# EAGLE board protol (EAGLE 6.6.0)
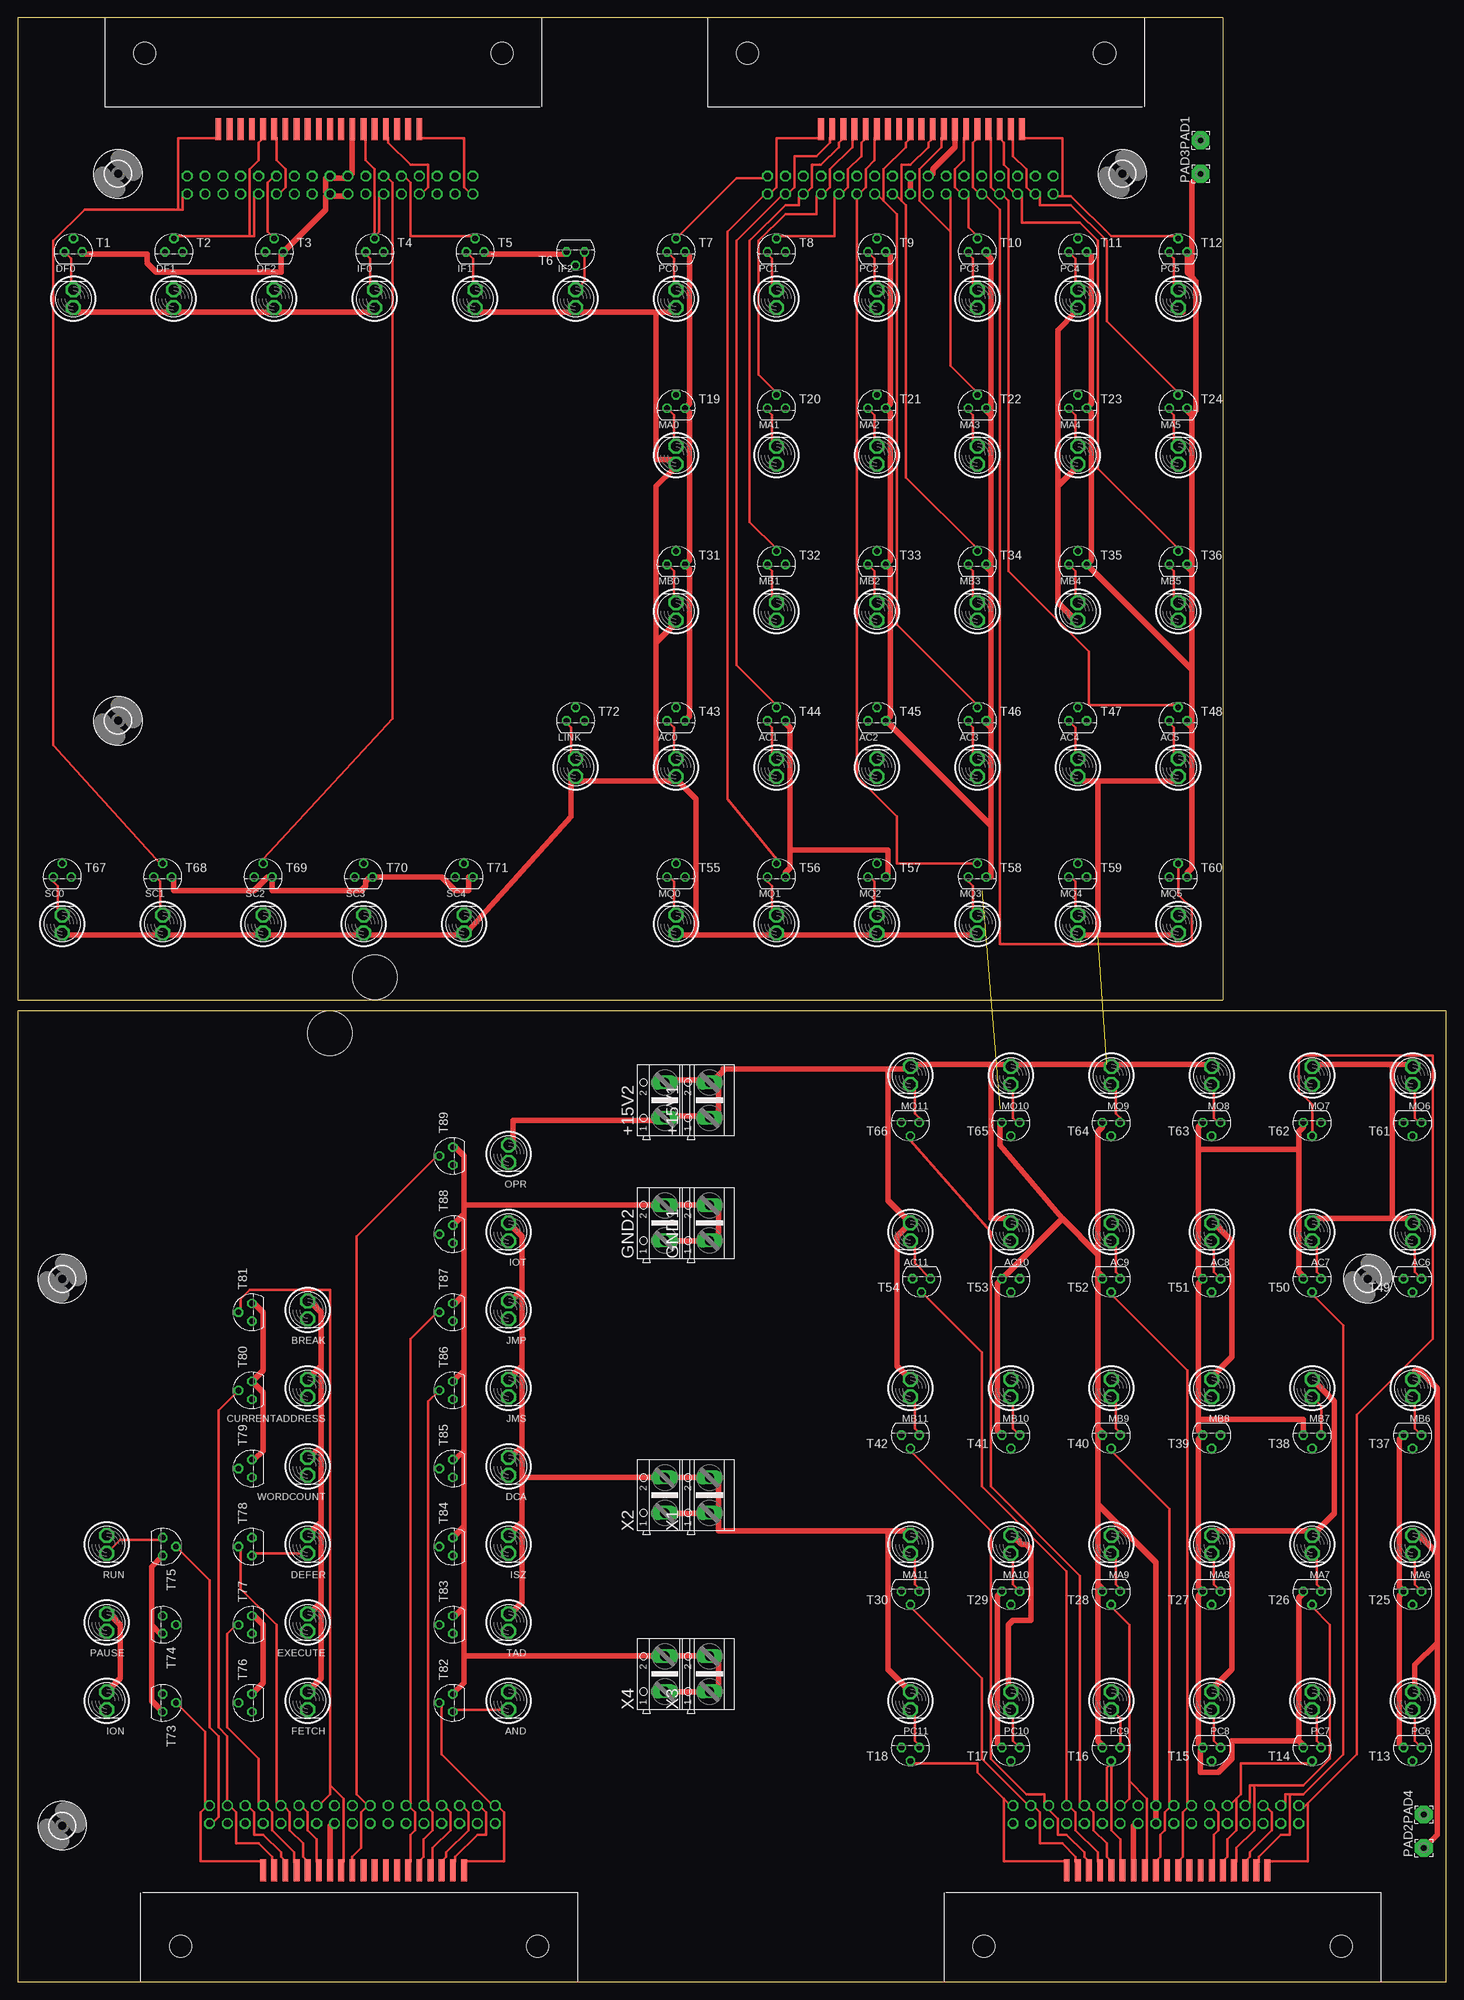
[diagram p2: board, top side]
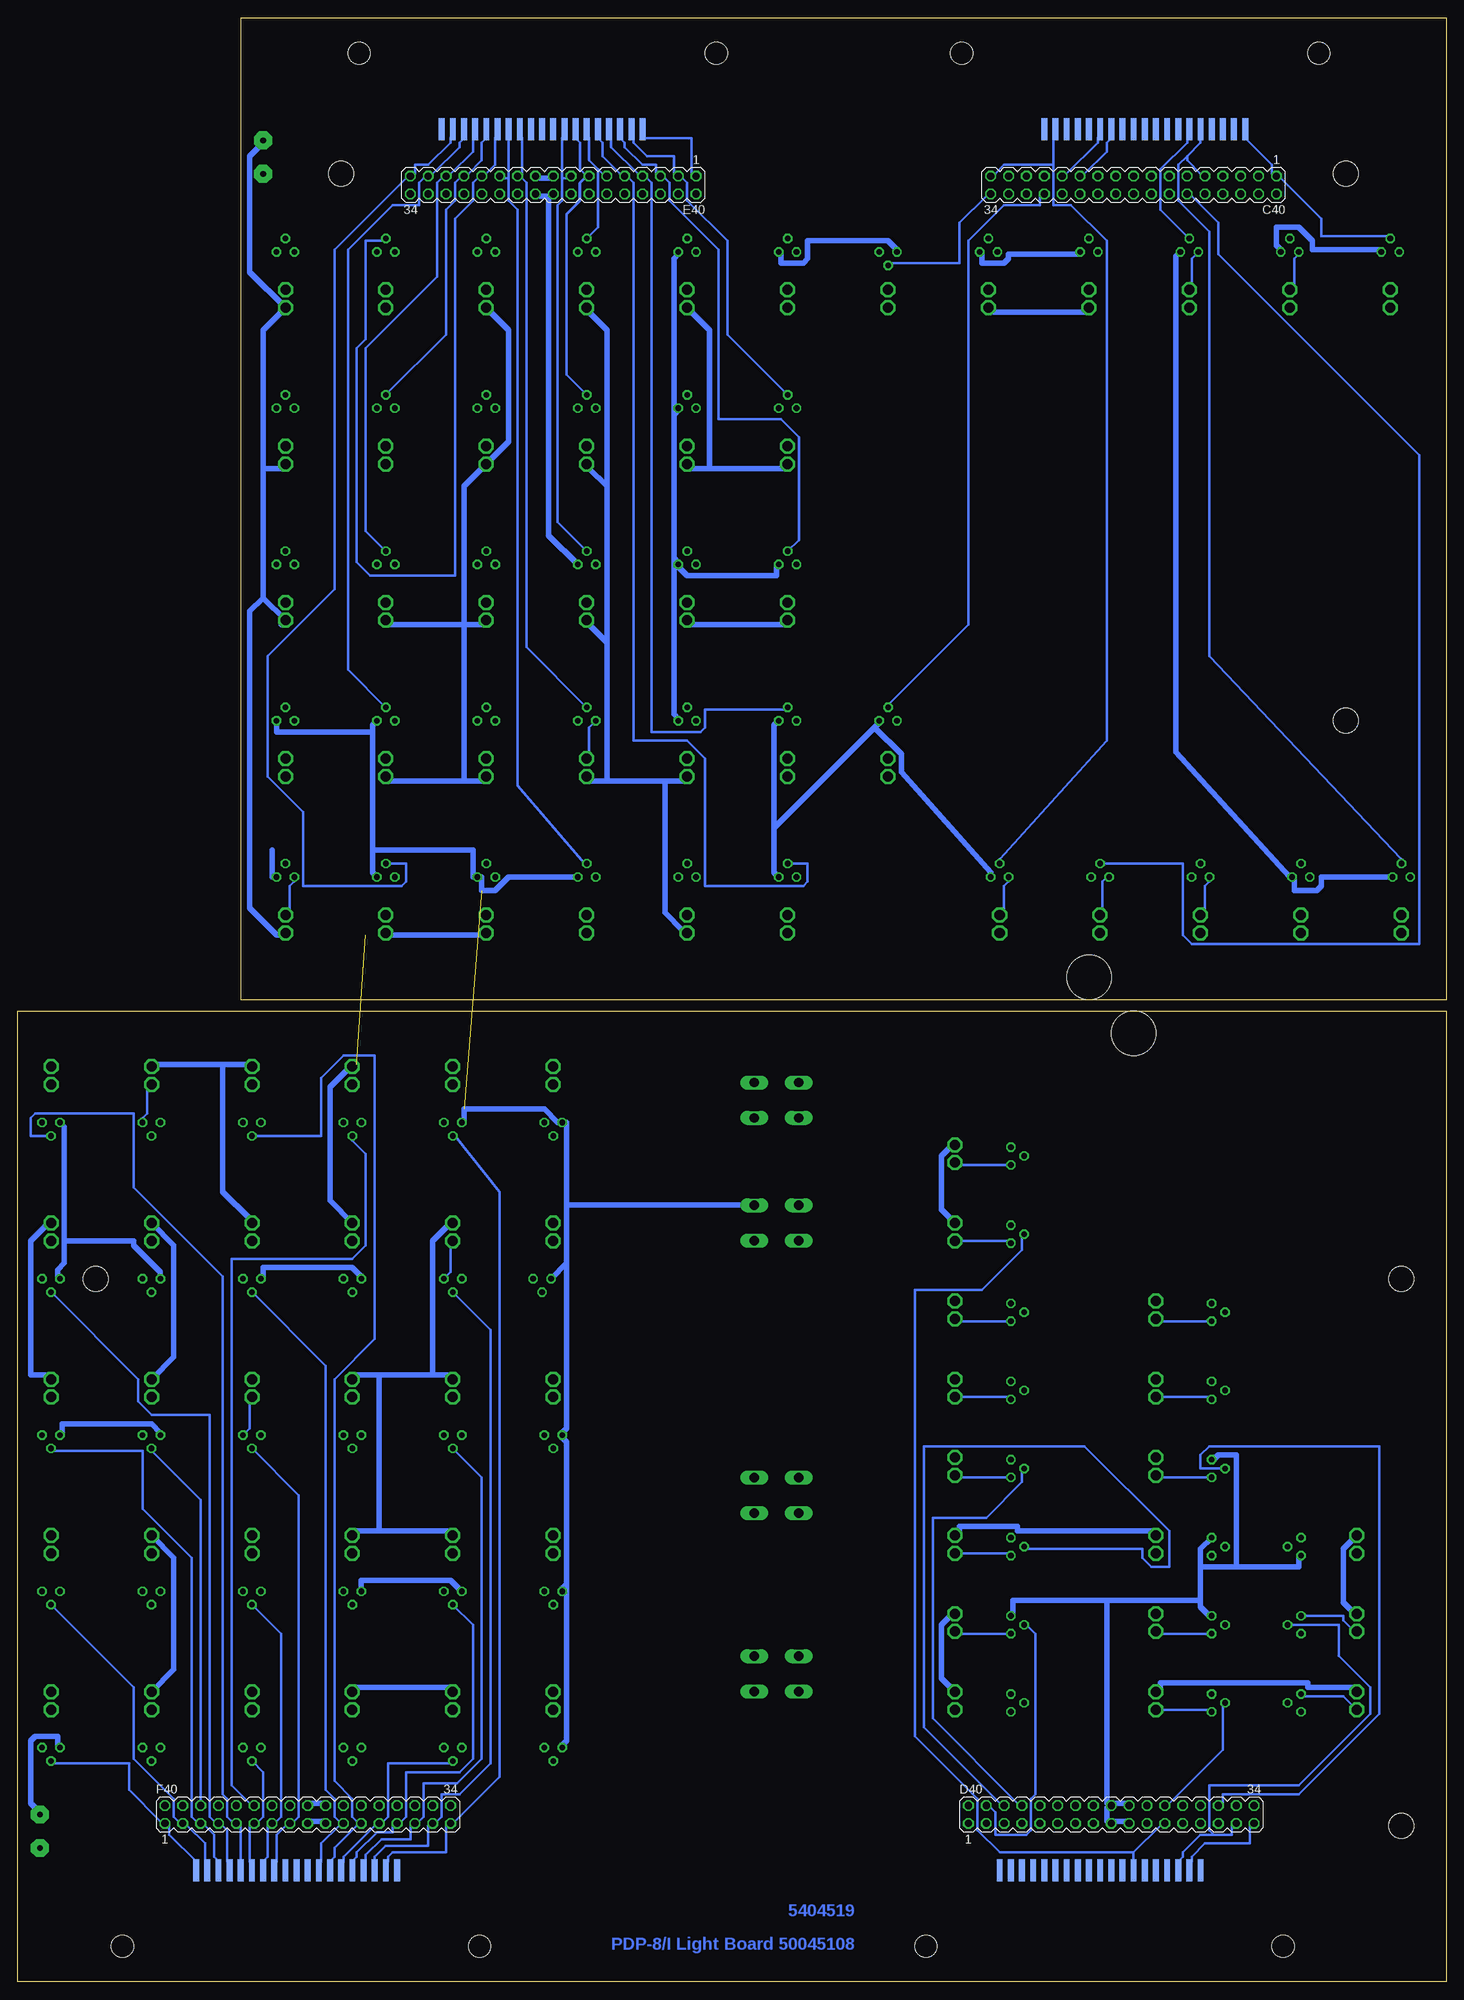
[diagram p3: board, bottom side, seen from below]

Size 203.2 x 279.4 mm. Coordinates in mm from the lower left corner, seen from the top.
Outline: 0,139.7 171.45,139.7 171.45,279.4 0,279.4 0,139.7
Outline: 203.2,138.11 0,138.11 0,0 203.2,0 203.2,138.11
Copper layers (1*16): Top 0.035mm / dielectric 1.5mm / Bottom 0.035mm
Design rules "15mils": minimum track width 15mil, minimum drill 24mil, track to track 15mil, track to pad 10mil, pad to pad 10mil, via to via 10mil, smd to smd 10mil, copper to edge 25mil, drill to drill 10mil, minimum pad ring 10mil, minimum via ring 8mil, stop-mask expansion 0mil, vias tented up to drill 0mil, thermal gap 10mil
Net classes: 1 supply: width 0.762 mm
Holes 6.35 mm at 50.8,142.88 44.45,134.94

## Footprints (pad centres in the part's own frame; a part is rotated, then mirrored left to right if it is on the bottom)
AK500/2 = drill 1.321 long: 1 -2.515,0; 2 2.515,0
BULB = drill 1.422 octagon: A 0,0; B 0,2.54
MA17-2 = drill 1.016 octagon: 1 -20.32,-1.27; 2 -20.32,1.27; 3 -17.78,-1.27; 4 -17.78,1.27; 5 -15.24,-1.27; 6 -15.24,1.27; 7 -12.7,-1.27; 8 -12.7,1.27; 9 -10.16,-1.27; 10 -10.16,1.27; 11 -7.62,-1.27; 12 -7.62,1.27; 13 -5.08,-1.27; 14 -5.08,1.27; 15 -2.54,-1.27; 16 -2.54,1.27; 17 0,-1.27; 18 0,1.27; 19 2.54,-1.27; 20 2.54,1.27; 21 5.08,-1.27; 22 5.08,1.27; 23 7.62,-1.27; 24 7.62,1.27; 25 10.16,-1.27; 26 10.16,1.27; 27 12.7,-1.27; 28 12.7,1.27; 29 15.24,-1.27; 30 15.24,1.27; 31 17.78,-1.27; 32 17.78,1.27; 33 20.32,-1.27; 34 20.32,1.27
FLEX19 = smd 3.175 x 0.838: 1 0,14.287; 2 0,12.7; 3 0,11.113; 4 0,9.525; 5 0,7.938; 6 0,6.35; 7 0,4.763; 8 0,3.175; 9 0,1.587; 10 0,0; 11 0,-1.587; 12 0,-3.175; 13 0,-4.763; 14 0,-6.35; 15 0,-7.938; 16 0,-9.525; 17 0,-11.113; 18 0,-12.7; 19 0,-14.287
2,54/0,8 = drill 0.813 pad 2.54 octagon: 1 0,0
TO92 = drill 0.813 octagon: 1 1.27,0; 2 0,1.905; 3 -1.27,0
STRAIN-RELIEF = hole 3.175: 7.62,56.515; 7.62,5.715
3,6 = hole 3.6: 0,0

## Placement (x,y rotation side)
+15V1  494864  [AK500/2]  98.42,125.41 90 top
+15V2  494864  [AK500/2]  92.08,125.41 90 top
AC0  [BULB]  93.66,171.45 0 top
AC1  [BULB]  107.95,171.45 0 top
AC2  [BULB]  122.24,171.45 0 top
AC3  [BULB]  136.53,171.45 0 top
AC4  [BULB]  150.81,171.45 0 top
AC5  [BULB]  165.1,171.45 0 top
AC6  [BULB]  198.44,107.95 180 top
AC7  [BULB]  184.15,107.95 180 top
AC8  [BULB]  169.86,107.95 180 top
AC9  [BULB]  155.57,107.95 180 top
AC10  [BULB]  141.29,107.95 180 top
AC11  [BULB]  127,107.95 180 top
AND  [BULB]  69.85,41.27 180 top
BREAK  [BULB]  41.27,96.84 180 top
C40  [MA17-2]  44.45,255.59 180 bottom
C40BOT  FLEX19  [FLEX19]  42.86,263.52 90 top
C40TOP  FLEX19  [FLEX19]  42.86,263.52 270 bottom
CURRENTADDRESS  [BULB]  41.27,85.72 180 top
D40  [MA17-2]  47.62,23.81 0 bottom
D40BOT  FLEX19  [FLEX19]  128.59,263.52 90 top
D40TOP  FLEX19  [FLEX19]  128.59,263.52 270 bottom
DCA  [BULB]  69.85,74.61 180 top
DEFER  [BULB]  41.27,63.5 180 top
DF0  [BULB]  7.94,238.12 0 top
DF1  [BULB]  22.23,238.12 0 top
DF2  [BULB]  36.51,238.12 0 top
E40  [MA17-2]  127,255.59 180 bottom
E40BOT  FLEX19  [FLEX19]  163.51,15.88 270 top
E40TOP  FLEX19  [FLEX19]  163.51,15.88 90 bottom
EXECUTE  [BULB]  41.27,52.39 180 top
F40  [MA17-2]  161.93,23.81 0 bottom
F40BOT  FLEX19  [FLEX19]  49.21,15.88 270 top
F40TOP  FLEX19  [FLEX19]  49.21,15.88 90 bottom
FETCH  [BULB]  41.27,41.27 180 top
GND1  494864  [AK500/2]  98.42,107.95 90 top
GND2  494864  [AK500/2]  92.08,107.95 90 top
IF0  [BULB]  50.8,238.12 0 top
IF1  [BULB]  65.09,238.12 0 top
IF2  [BULB]  79.38,238.12 0 top
ION  [BULB]  12.7,41.27 180 top
IOT  [BULB]  69.85,107.95 180 top
ISZ  [BULB]  69.85,63.5 180 top
JMP  [BULB]  69.85,96.84 180 top
JMS  [BULB]  69.85,85.72 180 top
LINK  [BULB]  79.38,171.45 0 top
MA0  [BULB]  93.66,215.9 0 top
MA1  [BULB]  107.95,215.9 0 top
MA2  [BULB]  122.24,215.9 0 top
MA3  [BULB]  136.53,215.9 0 top
MA4  [BULB]  150.81,215.9 0 top
MA5  [BULB]  165.1,215.9 0 top
MA6  [BULB]  198.44,63.5 180 top
MA7  [BULB]  184.15,63.5 180 top
MA8  [BULB]  169.86,63.5 180 top
MA9  [BULB]  155.57,63.5 180 top
MA10  [BULB]  141.29,63.5 180 top
MA11  [BULB]  127,63.5 180 top
MB0  [BULB]  93.66,193.68 0 top
MB1  [BULB]  107.95,193.68 0 top
MB2  [BULB]  122.24,193.68 0 top
MB3  [BULB]  136.53,193.68 0 top
MB4  [BULB]  150.81,193.68 0 top
MB5  [BULB]  165.1,193.68 0 top
MB6  [BULB]  198.44,85.72 180 top
MB7  [BULB]  184.15,85.72 180 top
MB8  [BULB]  169.86,85.72 180 top
MB9  [BULB]  155.57,85.72 180 top
MB10  [BULB]  141.29,85.72 180 top
MB11  [BULB]  127,85.72 180 top
MQ0  [BULB]  93.66,149.22 0 top
MQ1  [BULB]  107.95,149.22 0 top
MQ2  [BULB]  122.24,149.22 0 top
MQ3  [BULB]  136.53,149.22 0 top
MQ4  [BULB]  150.81,149.22 0 top
MQ5  [BULB]  165.1,149.22 0 top
MQ6  [BULB]  198.44,130.18 180 top
MQ7  [BULB]  184.15,130.18 180 top
MQ8  [BULB]  169.86,130.18 180 top
MQ9  [BULB]  155.57,130.18 180 top
MQ10  [BULB]  141.29,130.18 180 top
MQ11  [BULB]  127,130.18 180 top
OPR  [BULB]  69.85,119.06 180 top
PAD1  [2,54/0,8]  168.28,261.94 90 top
PAD2  [2,54/0,8]  200.03,19.05 90 top
PAD3  [2,54/0,8]  168.28,257.18 90 top
PAD4  [2,54/0,8]  200.03,23.81 90 top
PAUSE  [BULB]  12.7,52.39 180 top
PC0  [BULB]  93.66,238.12 0 top
PC1  [BULB]  107.95,238.12 0 top
PC2  [BULB]  122.24,238.12 0 top
PC3  [BULB]  136.53,238.12 0 top
PC4  [BULB]  150.81,238.12 0 top
PC5  [BULB]  165.1,238.12 0 top
PC6  [BULB]  198.44,41.27 180 top
PC7  [BULB]  184.15,41.27 180 top
PC8  [BULB]  169.86,41.27 180 top
PC9  [BULB]  155.57,41.27 180 top
PC10  [BULB]  141.29,41.27 180 top
PC11  [BULB]  127,41.27 180 top
RUN  [BULB]  12.7,63.5 180 top
SC0  [BULB]  6.35,149.22 0 top
SC1  [BULB]  20.64,149.22 0 top
SC2  [BULB]  34.92,149.22 0 top
SC3  [BULB]  49.21,149.22 0 top
SC4  [BULB]  63.5,149.22 0 top
T1  2N2222  [TO92]  7.94,246.06 0 top
T2  2N2222  [TO92]  22.23,246.06 0 top
T3  2N2222  [TO92]  36.51,246.06 0 top
T4  2N2222  [TO92]  50.8,246.06 0 top
T5  2N2222  [TO92]  65.09,246.06 0 top
T6  2N2222  [TO92]  79.38,246.06 180 top
T7  2N2222  [TO92]  93.66,246.06 0 top
T8  2N2222  [TO92]  107.95,246.06 0 top
T9  2N2222  [TO92]  122.24,246.06 0 top
T10  2N2222  [TO92]  136.53,246.06 0 top
T11  2N2222  [TO92]  150.81,246.06 0 top
T12  2N2222  [TO92]  165.1,246.06 0 top
T13  2N2222  [TO92]  198.44,33.34 180 top
T14  2N2222  [TO92]  184.15,33.34 180 top
T15  2N2222  [TO92]  169.86,33.34 180 top
T16  2N2222  [TO92]  155.57,33.34 180 top
T17  2N2222  [TO92]  141.29,33.34 180 top
T18  2N2222  [TO92]  127,33.34 180 top
T19  2N2222  [TO92]  93.66,223.84 0 top
T20  2N2222  [TO92]  107.95,223.84 0 top
T21  2N2222  [TO92]  122.24,223.84 0 top
T22  2N2222  [TO92]  136.53,223.84 0 top
T23  2N2222  [TO92]  150.81,223.84 0 top
T24  2N2222  [TO92]  165.1,223.84 0 top
T25  2N2222  [TO92]  198.44,55.56 180 top
T26  2N2222  [TO92]  184.15,55.56 180 top
T27  2N2222  [TO92]  169.86,55.56 180 top
T28  2N2222  [TO92]  155.57,55.56 180 top
T29  2N2222  [TO92]  141.29,55.56 180 top
T30  2N2222  [TO92]  127,55.56 180 top
T31  2N2222  [TO92]  93.66,201.61 0 top
T32  2N2222  [TO92]  107.95,201.61 0 top
T33  2N2222  [TO92]  122.24,201.61 0 top
T34  2N2222  [TO92]  136.53,201.61 0 top
T35  2N2222  [TO92]  150.81,201.61 0 top
T36  2N2222  [TO92]  165.1,201.61 0 top
T37  2N2222  [TO92]  198.44,77.79 180 top
T38  2N2222  [TO92]  184.15,77.79 180 top
T39  2N2222  [TO92]  169.86,77.79 180 top
T40  2N2222  [TO92]  155.57,77.79 180 top
T41  2N2222  [TO92]  141.29,77.79 180 top
T42  2N2222  [TO92]  127,77.79 180 top
T43  2N2222  [TO92]  93.66,179.39 0 top
T44  2N2222  [TO92]  107.95,179.39 0 top
T45  2N2222  [TO92]  122.24,179.39 0 top
T46  2N2222  [TO92]  136.53,179.39 0 top
T47  2N2222  [TO92]  150.81,179.39 0 top
T48  2N2222  [TO92]  165.1,179.39 0 top
T49  2N2222  [TO92]  198.44,100.01 180 top
T50  2N2222  [TO92]  184.15,100.01 180 top
T51  2N2222  [TO92]  169.86,100.01 180 top
T52  2N2222  [TO92]  155.57,100.01 180 top
T53  2N2222  [TO92]  141.29,100.01 180 top
T54  2N2222  [TO92]  128.59,100.01 180 top
T55  2N2222  [TO92]  93.66,157.16 0 top
T56  2N2222  [TO92]  107.95,157.16 0 top
T57  2N2222  [TO92]  122.24,157.16 0 top
T58  2N2222  [TO92]  136.53,157.16 0 top
T59  2N2222  [TO92]  150.81,157.16 0 top
T60  2N2222  [TO92]  165.1,157.16 0 top
T61  2N2222  [TO92]  198.44,122.24 180 top
T62  2N2222  [TO92]  184.15,122.24 180 top
T63  2N2222  [TO92]  169.86,122.24 180 top
T64  2N2222  [TO92]  155.57,122.24 180 top
T65  2N2222  [TO92]  141.29,122.24 180 top
T66  2N2222  [TO92]  127,122.24 180 top
T67  2N2222  [TO92]  6.35,157.16 0 top
T68  2N2222  [TO92]  20.64,157.16 0 top
T69  2N2222  [TO92]  34.92,157.16 0 top
T70  2N2222  [TO92]  49.21,157.16 0 top
T71  2N2222  [TO92]  63.5,157.16 0 top
T72  2N2222  [TO92]  79.38,179.39 0 top
T73  2N2222  [TO92]  20.64,39.69 270 top
T74  2N2222  [TO92]  20.64,50.8 270 top
T75  2N2222  [TO92]  20.64,61.91 270 top
T76  2N2222  [TO92]  33.34,39.69 90 top
T77  2N2222  [TO92]  33.34,50.8 90 top
T78  2N2222  [TO92]  33.34,61.91 90 top
T79  2N2222  [TO92]  33.34,73.03 90 top
T80  2N2222  [TO92]  33.34,84.14 90 top
T81  2N2222  [TO92]  33.34,95.25 90 top
T82  2N2222  [TO92]  61.91,39.69 90 top
T83  2N2222  [TO92]  61.91,50.8 90 top
T84  2N2222  [TO92]  61.91,61.91 90 top
T85  2N2222  [TO92]  61.91,73.03 90 top
T86  2N2222  [TO92]  61.91,84.14 90 top
T87  2N2222  [TO92]  61.91,95.25 90 top
T88  2N2222  [TO92]  61.91,106.36 90 top
T89  2N2222  [TO92]  61.91,117.47 90 top
TAD  [BULB]  69.85,52.39 180 top
U$1  [STRAIN-RELIEF]  74.61,266.7 90 top
U$2  [STRAIN-RELIEF]  160.34,266.7 90 top
U$3  [STRAIN-RELIEF]  131.76,12.7 270 top
U$4  [STRAIN-RELIEF]  17.46,12.7 270 top
U$5  [3,6]  6.35,22.23 180 top
U$6  [3,6]  6.35,100.01 180 top
U$7  [3,6]  192.09,100.01 180 top
U$8  [3,6]  14.29,179.39 0 top
U$9  [3,6]  14.29,257.18 0 top
U$11  [3,6]  157.16,257.18 0 top
WORDCOUNT  [BULB]  41.27,74.61 180 top
X1  494864  [AK500/2]  98.42,69.22 90 top
X2  494864  [AK500/2]  92.08,69.22 90 top
X3  494864  [AK500/2]  98.42,43.81 90 top
X4  494864  [AK500/2]  92.08,43.81 90 top

## Tracks (layer width: path | path; a pad name or v marks a point on that pad's centre or on a via)
+15V  (1 unrouted)
  Top 0.762: ION.A 14.61,43.18 14.61,50.8 13.34,52.07 PAUSE.A | 43.18,87.63 43.18,95.25 41.91,96.52 BREAK.A | 43.18,87.63 CURRENTADDRESS.A | 43.18,76.2 41.91,74.93 WORDCOUNT.A | 43.18,76.2 43.18,87.63 | 43.18,65.41 43.18,76.2 | DEFER.A 43.18,65.41 | 43.18,53.98 41.91,52.7 EXECUTE.A | 43.18,65.41 43.18,53.98 | 43.18,53.98 43.18,43.18 FETCH.A | X1.1 96.52,66.67 93.98,66.67 X2.1 | X1.1 99.69,67.31 99.69,71.12 X1.2 96.52,71.75 93.98,71.75 X2.2 90.17,71.75 71.75,71.75 | +15V1.2 96.52,128.27 93.98,128.27 +15V2.2 | +15V1.2 99.69,127 99.69,123.83 +15V1.1 96.52,123.19 93.98,123.19 +15V2.1 90.17,122.56 70.48,122.56 70.48,119.38 OPR.A | 71.75,98.42 70.48,97.16 JMP.A | 71.75,98.42 71.75,106.05 IOT.A | 71.75,98.42 71.75,87.63 | 71.75,87.63 JMS.A | 71.75,76.2 70.48,74.93 DCA.A | 71.75,87.63 71.75,76.2 | 71.75,76.2 71.75,71.75 | 71.75,71.75 71.75,65.41 | 71.75,65.41 ISZ.A | 71.75,65.41 71.75,53.98 70.48,52.7 TAD.A | 123.83,64.14 99.69,64.14 99.69,66.04 X1.1 | 123.83,64.14 126.36,64.14 MA11.A | DF0.A 8.26,237.49 21.59,237.49 DF1.A 22.86,237.49 36.2,237.49 DF2.A 36.83,237.49 50.16,237.49 IF0.A | IF1.A 65.41,237.49 78.74,237.49 IF2.A 80.01,237.49 90.81,237.49 | 90.81,237.49 93.34,237.49 PC0.A | 90.81,237.49 90.81,216.53 93.34,216.53 MA0.A 93.34,215.26 90.81,212.72 90.81,190.5 | PC5.A 165.74,237.49 | 172.72,64.14 170.18,64.14 MA8.A | 172.72,64.14 183.51,64.14 MA7.A 187.32,66.67 187.32,82.55 MB7.A | 172.72,64.14 172.72,44.45 170.18,41.91 PC8.A | 195.58,108.58 184.78,108.58 AC7.A | 195.58,108.58 198.12,108.58 AC6.A | 147.96,212.72 150.5,215.26 MA4.A | 147.96,212.72 147.96,196.22 150.5,193.68 MB4.A | 147.96,212.72 147.96,234.95 150.5,237.49 PC4.A
  Top 0.762: SC0.A 6.99,148.91 20.32,148.91 SC1.A 20.95,148.91 34.29,148.91 SC2.A 35.56,148.91 48.9,148.91 SC3.A 49.53,148.91 62.87,148.91 SC4.A 64.14,149.54 78.74,165.74 78.74,170.81 LINK.A 80.01,170.81 90.81,170.81 | AC10.A 140.97,108.58 138.43,108.58 138.43,130.49 | MB11.A 125.09,87.63 125.09,106.05 AC11.A 123.83,111.12 123.83,129.86 | 153.67,170.81 151.13,170.81 AC4.A | 153.67,170.81 164.47,170.81 AC5.A | 90.81,170.81 93.34,170.81 AC0.A 93.98,170.81 96.52,168.28 96.52,148.91 | 96.52,148.91 107.31,148.91 MQ1.A 108.58,148.91 121.92,148.91 MQ2.A 122.56,148.91 135.89,148.91 MQ3.A | 96.52,148.91 93.98,148.91 MQ0.A | 153.67,148.91 151.13,148.91 MQ4.A | 153.67,148.91 164.47,148.91 MQ5.A | 195.58,130.49 198.12,130.49 MQ6.A | 195.58,130.49 184.78,130.49 MQ7.A | MB8.A 170.18,86.36 172.72,88.9 172.72,105.41 170.18,107.95 AC8.A | MQ8.A 169.54,130.49 156.21,130.49 MQ9.A 154.94,130.49 141.6,130.49 MQ10.A 140.97,130.49 138.43,130.49 | 138.43,130.49 127.64,130.49 MQ11.A 126.36,129.86 123.83,129.86 | 90.81,190.5 93.34,193.04 MB0.A | 90.81,170.81 90.81,190.5 | 153.67,148.91 153.67,170.81 | 195.58,130.49 195.58,108.58 | 123.83,129.86 100.33,129.86 100.33,129.54 99.69,128.91 +15V1.2 | 123.83,64.14 123.83,44.45 PC11.A | PC10.A 140.97,41.91 140.97,50.8 141.6,51.44 144.15,51.44 144.15,61.59 143.51,62.23 142.88,62.23 142.24,62.87 141.6,62.87 MA10.A | 201.93,48.26 198.75,45.09 198.75,41.91 PC6.A | 201.93,60.96 201.93,48.26 | 201.93,60.96 198.75,64.14 MA6.A | 201.93,60.96 201.93,84.45 199.39,87 198.75,87 198.75,86.36 MB6.A | 201.93,48.26 201.93,20.95 PAD2.1
  Bottom 0.762: RUN.A 14.61,61.59 14.61,53.98 13.34,52.7 PAUSE.A | ION.A 13.34,41.91 19.68,41.91 19.68,42.55 40.64,42.55 40.64,41.91 FETCH.A | 144.15,86.36 151.76,86.36 | 151.76,86.36 154.94,86.36 MB9.A | 144.15,86.36 141.6,86.36 MB10.A | OPR.A 70.48,118.75 71.75,117.47 71.75,109.86 IOT.A | AND.A 71.75,43.18 71.75,50.8 70.48,52.07 TAD.A | DEFER.A 41.91,64.14 60.96,64.14 60.96,64.77 69.22,64.77 69.22,64.14 ISZ.A | 104.78,215.26 107.31,215.26 MA1.A | 104.78,215.26 93.98,215.26 MA0.A | 104.78,215.26 104.78,234.95 PC1.A | IF1.A 64.77,237.49 51.44,237.49 IF0.A | 165.74,193.04 MB5.A 168.28,196.85 | MB6.A 198.75,86.36 201.29,86.36 201.29,105.41 198.75,107.95 AC6.A | 168.28,215.26 165.74,215.26 MA5.A | MA6.A 198.75,64.14 | 168.28,196.85 168.28,215.26 | 168.28,215.26 168.28,234.95 PC5.A 170.18,243.21 170.18,259.71 168.91,260.99 PAD1.1 | PC7.A 180.97,44.45 180.97,60.33 MA7.A | MB7.A 180.97,88.9 180.97,104.78 AC7.A | 119.38,170.81 121.92,170.81 AC2.A | 111.12,170.81 119.38,170.81 | 111.12,170.81 108.58,170.81 AC1.A | 119.38,190.5 121.92,193.04 MB2.A | 119.38,170.81 119.38,190.5 | 119.38,212.72 121.92,215.26 MA2.A | 119.38,190.5 119.38,212.72 | 119.38,212.72 119.38,234.95 121.92,237.49 PC2.A | 139.7,193.04 150.5,193.04 MB4.A | 139.7,193.04 137.16,193.04 MB3.A | 139.7,193.04 139.7,212.72 MA3.A 133.35,219.07 133.35,234.95 PC3.A | 139.7,170.81 150.5,170.81 AC4.A | 139.7,170.81 137.16,170.81 AC3.A | MB0.A 93.98,193.04 107.31,193.04 MB1.A | MQ4.A 150.5,148.91 137.16,148.91 MQ3.A | MQ6.A 198.75,130.49 | 173.99,130.49 183.51,130.49 MQ7.A | 173.99,130.49 170.18,130.49 MQ8.A | 173.99,130.49 173.99,112.39 170.18,108.58 AC8.A | AC9.A 158.75,111.12 158.75,127.32 156.21,129.86 MQ9.A
  Bottom 0.762: 139.7,170.81 139.7,193.04 | 111.12,170.81 111.12,152.08 108.58,149.54 MQ1.A | 144.15,86.36 144.15,105.41 141.6,107.95 AC10.A | PC9.A 154.94,41.91 141.6,41.91 PC10.A | 151.76,64.14 154.94,64.14 MA9.A | 151.76,86.36 151.76,64.14 | 151.76,64.14 141.6,64.14 MA10.A | 168.28,196.85 170.18,194.94 170.18,152.72 166.37,148.91 165.74,148.91 MQ5.A
AC0
  Bottom 0.381: T43.2 93.98,180.97 105.41,180.97 105.41,178.44 106.05,177.8 113.03,177.8 113.03,255.91 113.67,256.54 E40.7 114.94,257.18 118.75,260.99 118.75,262.25 D40TOP.4
AC1
  Top 0.381: T44.2 107.95,181.61 102.23,187.32 102.23,247.65 108.58,254 E40.4 109.86,254.63 110.49,255.27 110.49,259.71 113.67,259.71 115.57,261.62 115.57,262.25 D40BOT.2
AC2
  Bottom 0.381: T45.2 130.81,189.87 130.81,255.91 131.44,256.54 E40.21 131.44,257.18 131.44,262.25 D40TOP.12
AC3
  Top 0.381: 123.19,253.37 122.56,254 E40.14 | 123.19,253.37 125.09,251.46 125.09,193.04 136.53,181.61 T46.2 | 123.19,253.37 123.19,257.81 126.36,260.99 126.36,261.62 127,262.25 D40BOT.9
AC4
  Bottom 0.381: T47.2 156.21,186.69 156.21,246.38 149.86,252.73 146.05,252.73 146.05,255.91 145.41,256.54 E40.31 144.15,257.18 140.34,260.99 140.34,261.62 139.7,262.25 D40TOP.17
AC5
  Top 0.381: T48.2 165.1,181.61 152.4,181.61 152.4,189.23 140.97,200.66 140.97,253.37 140.34,254 E40.28 139.06,254.63 138.43,255.27 138.43,262.25 D40BOT.16
AC6
  Bottom 0.381: T49.2 186.06,85.72 186.06,82.55 184.15,80.64 175.9,80.64 175.9,23.5 175.26,22.86 F40.7 173.99,22.23 173.35,21.59 173.35,17.14 E40TOP.4
AC7
  Top 0.381: 180.97,26.67 180.34,26.67 180.34,25.4 F40.4 | 180.97,26.67 182.88,26.67 188.59,32.38 188.59,93.34 184.15,97.79 T50.2 | 180.97,26.67 180.97,20.95 179.71,20.95 176.53,17.78 176.53,17.14 E40BOT.2
AC8
  Bottom 0.381: T51.2 159.38,87.63 159.38,27.3 158.12,26.04 158.12,23.5 157.48,22.86 F40.21 157.48,22.23 160.02,19.68 160.02,17.14 E40TOP.12
AC9
  Top 0.381: T52.2 155.57,97.79 166.37,87 166.37,25.4 F40.14 166.37,24.77 165.74,24.13 165.74,17.78 165.1,17.14 E40BOT.9
AC10
  Bottom 0.381: T53.2 135.89,92.71 135.89,31.11 140.34,26.67 142.88,26.67 142.88,23.5 143.51,22.86 F40.31 144.78,22.23 144.78,19.37 150.81,19.37 152.4,17.78 E40TOP.17
AC11
  Top 0.381: T54.2 137.16,89.53 137.16,70.48 149.22,58.42 F40.28 149.86,24.77 150.5,24.13 150.5,21.59 153.67,18.41 153.67,17.14 E40BOT.16
AND
  Top 0.381: T82.2 60.33,39.37 60.33,32.38 67.31,25.4 D40.2 68.58,24.77 69.22,24.13 69.22,17.14 63.5,17.14 F40BOT.1
BREAK
  Top 0.381: 44.45,27.94 44.45,26.67 43.18,25.4 D40.22 | 44.45,27.94 44.45,98.42 33.02,98.42 31.75,97.16 31.75,95.25 T81.2 | 44.45,27.94 46.35,26.04 46.35,17.14 F40BOT.12
CA
  Top 0.381: T80.2 28.57,81.28 28.57,36.2 29.84,34.92 D40.32 30.48,24.77 31.11,24.13 31.11,19.68 34.29,19.68 36.2,17.78 36.2,17.14 F40BOT.18
DCA
  Top 0.381: F40BOT.4 59.05,17.14 59.05,19.05 61.59,21.59 61.59,24.13 60.96,24.77 D40.8
  Bottom 0.381: T85.2 60.33,73.03 60.33,71.12 65.41,66.04 73.03,66.04 73.03,37.47 60.96,25.4 D40.8
DEFER
  Top 0.381: T78.2 31.75,61.59 31.75,55.88 36.83,50.8 36.83,25.4 D40.26 38.1,24.77 38.73,24.13 38.73,21.59 40.64,19.68 40.64,17.78 41.27,17.14 F40BOT.15
DF0
  Bottom 0.381: T1.2 8.26,248.28 17.78,248.28 17.78,250.82 23.5,256.54 C40.1 24.77,257.18 24.77,258.44 28.57,262.25 C40TOP.1
DF1
  Top 0.381: 33.02,248.28 33.66,248.28 33.66,254 C40.10 | 33.02,248.28 22.23,248.28 T2.2 | 33.02,248.28 33.02,257.81 34.29,259.08 34.29,261.62 34.92,262.25 C40BOT.5
DF2
  Top 0.381: T3.2 35.56,248.92 35.56,255.91 36.2,256.54 C40.11
  Bottom 0.381: C40TOP.6 36.83,262.25 36.83,261.62 40.64,257.81 40.64,252.09 T3.2
EXECUTE
  Top 0.381: T77.2 31.11,50.8 29.84,49.53 29.84,36.2 34.29,31.75 34.29,25.4 D40.28 35.56,24.77 36.2,24.13 36.2,21.59 39.37,18.41 39.37,17.14 F40BOT.16
FETCH
  Top 0.381: F40BOT.14 42.55,17.14 42.55,20.32 41.27,21.59 41.27,24.13 40.64,24.77 D40.24
  Bottom 0.381: T76.2 31.75,39.37 31.75,33.02 39.37,25.4 D40.24
GND  (1 unrouted)
  Top 0.762: T76.1 34.92,42.55 34.92,50.8 33.66,52.07 T77.1 | 19.05,50.8 19.05,59.05 T75.1 | 19.05,50.8 20.32,49.53 T74.1 | 19.05,50.8 19.05,40.01 T73.1 | 63.5,110.49 63.5,117.47 62.23,118.75 T89.1 | 63.5,110.49 63.5,109.22 | 63.5,109.22 T88.1 | 63.5,97.79 62.23,96.52 T87.1 | 63.5,109.22 63.5,97.79 | 63.5,97.79 63.5,87 | 63.5,87 T86.1 | 63.5,75.56 62.23,74.3 T85.1 | 63.5,87 63.5,75.56 | 63.5,75.56 63.5,64.77 | 63.5,64.77 T84.1 | 63.5,53.34 62.23,52.07 T83.1 | 63.5,64.77 63.5,53.34 | 63.5,53.34 63.5,46.35 | 63.5,46.35 63.5,42.55 T82.1 | T41.1 139.38,78.42 139.38,99.38 T53.1 148.59,108.58 | X4.1 93.98,41.27 96.52,41.27 X3.1 99.69,41.91 99.69,45.72 X3.2 96.52,46.35 93.98,46.35 X4.2 90.17,46.35 63.5,46.35 | GND2.1 93.98,105.41 96.52,105.41 GND1.1 99.69,106.05 99.69,109.86 GND1.2 96.52,110.49 93.98,110.49 GND2.2 90.17,110.49 63.5,110.49 | 153.67,103.5 153.67,100.97 | 153.67,103.5 153.67,120.97 154.31,121.6 T64.1 | 153.67,100.97 154.31,100.33 T52.1 | 153.67,78.74 154.31,78.11 T40.1 | 153.67,100.97 153.67,78.74 | 153.67,56.52 154.31,55.88 T28.1 | 153.67,78.74 153.67,67.94 | 153.67,67.94 153.67,56.52 | 148.59,108.58 153.67,103.5 | 148.59,108.58 139.7,119.06 139.7,122.24 T65.1 | 182.25,34.29 182.25,54.61 182.88,55.24 T26.1 | 182.25,34.29 182.88,33.66 T14.1 | 182.25,118.43 182.25,100.97 182.88,100.33 T50.1 | 182.25,118.43 182.25,120.97 182.88,121.6 T62.1 | 167.96,118.43 167.96,100.65 T51.1 167.96,99.38 167.96,80.01 | 167.96,118.43 167.96,121.6 T63.1 | 167.96,80.01 167.96,78.42 T39.1 167.96,77.15 167.96,56.2 T27.1 167.96,54.93 167.96,33.97 T15.1 168.28,33.02 168.28,29.84 170.81,29.84 172.72,31.75 172.72,34.29 182.25,34.29
  Top 0.762: 167.96,118.43 182.25,118.43 | T37.1 196.53,77.15 196.53,56.2 T25.1 196.53,54.93 196.53,33.97 T13.1 | T11.1 152.72,245.43 152.72,224.47 T23.1 152.72,223.2 152.72,202.25 T35.1 167,186.69 | 167,178.44 167,158.43 166.37,157.8 T60.1 | 167,178.44 166.37,179.07 T48.1 | 167,200.66 166.37,201.29 T36.1 | 167,178.44 167,186.69 | 167,186.69 167,200.66 | 167,222.88 166.37,223.52 T24.1 | 167,200.66 167,222.88 | 167.96,80.01 182.88,80.01 T38.1 | 109.86,160.97 109.86,178.44 109.22,179.07 T44.1 | 109.86,160.97 109.86,158.43 109.22,157.8 T56.1 | 109.86,160.97 123.83,160.97 123.83,157.16 T57.1 | T9.1 124.14,245.43 124.14,224.47 T21.1 124.14,223.2 124.14,202.25 T33.1 124.14,200.98 124.14,180.02 T45.1 138.43,164.47 | T1.1 9.53,245.75 18.41,245.75 18.41,244.47 19.68,243.21 37.47,243.21 37.47,245.75 T3.1 43.81,252.09 43.81,254 C40.18 | T71.1 64.14,157.16 64.14,155.26 62.23,155.26 60.33,157.16 T70.1 50.16,157.16 49.53,156.53 49.53,155.89 48.9,155.26 36.2,155.26 T69.1 35.56,157.16 33.66,155.26 22.23,155.26 22.23,157.16 T68.1 | T6.1 78.11,245.75 66.67,245.75 T5.1 | T43.1 95.57,180.02 95.57,200.98 T31.1 95.57,202.25 95.57,223.2 T19.1 95.57,224.47 95.57,245.43 T7.1 | T29.1 139.38,54.93 139.38,33.97 T17.1 | C40.18 45.09,254 46.35,254 C40.20 | C40BOT.13 47.62,257.18 C40.19 46.35,256.54 45.09,256.54 C40.17 43.81,256.54 43.81,254.63 C40.18 | F40BOT.13 44.45,22.23 D40.19 | T81.1 33.66,96.52 34.92,95.25 34.92,87 T80.1 34.92,83.82 34.92,75.56 33.66,74.3 T79.1 | D40BOT.13 133.35,260.99 130.18,257.81 130.18,257.18 E40.19 | E40.18 E40.17 | 138.43,178.44 137.79,179.07 T46.1 | 138.43,164.47 138.43,157.16 T58.1
  Top 0.762: 138.43,164.47 138.43,178.44 | 138.43,200.66 137.79,201.29 T34.1 | 138.43,178.44 138.43,200.66 | 138.43,222.88 137.79,223.52 T22.1 | 138.43,200.66 138.43,222.88 | 138.43,222.88 138.43,245.11 137.79,245.75 T10.1 | E40BOT.13 158.75,22.23 F40.19 | F40.17 F40.18 161.93,59.69 153.67,67.94 | 153.67,56.52 153.67,34.29 154.31,33.66 T16.1 | 167,242.57 167.64,241.94 167.64,223.52 167,222.88 | 167,242.57 166.37,243.21 T12.1 | 167,242.57 167,255.91 PAD3.1
  Bottom 0.762: 34.92,54.29 34.92,53.34 33.66,52.07 T77.1 | 34.92,54.29 34.92,59.05 | 34.92,59.05 34.92,61.59 T78.1 | 29.84,59.05 20.95,59.05 20.95,60.33 T75.1 | 34.92,59.05 29.84,59.05 | 48.26,54.29 61.59,54.29 61.59,52.07 T83.1 | 48.26,54.29 34.92,54.29 | 29.84,59.05 29.84,74.93 32.38,74.93 33.02,74.3 T79.1 | T65.1 139.7,122.24 139.7,124.14 128.27,124.14 126.36,122.24 T66.1 125.09,122.24 125.09,110.49 | T12.1 166.37,245.75 | T13.1 197.49,33.66 197.49,34.92 200.66,34.92 201.29,34.29 201.29,25.4 200.66,24.77 PAD4.1 | T38.1 182.88,78.11 184.15,79.38 196.85,79.38 196.85,78.11 T37.1 | 196.53,105.41 196.53,102.23 197.49,101.28 197.49,100.33 T49.1 | 196.53,105.41 196.53,121.6 T61.1 | 152.72,177.8 152.72,178.75 T47.1 | 152.72,160.97 152.72,177.8 | 152.72,160.97 152.72,157.8 T59.1 | 152.72,177.8 166.37,177.8 T48.1 | 167,160.97 167,157.16 T60.1 | T57.1 133.35,157.16 135.25,155.26 137.16,155.26 137.16,157.16 T58.1 138.43,157.16 138.43,160.97 152.72,160.97 | T1.1 9.53,246.38 19.05,246.38 19.05,247.65 20.95,249.56 24.13,249.56 24.13,247.01 23.5,246.38 T2.1 | T67.1 17.78,157.16 17.78,155.89 18.41,155.26 21.59,155.26 21.59,157.16 T68.1 22.23,157.16 38.42,174.94 38.42,245.43 T3.1 | T4.1 52.07,245.75 62.23,245.75 62.23,245.11 62.87,244.47 66.04,244.47 66.04,245.75 T5.1 | 95.57,164.15 95.57,178.75 T43.1 | 95.57,164.15 95.57,157.8 T55.1 | 81.28,178.44 95.57,164.15 | 81.28,178.44 80.64,179.07 T72.1 | T31.1 95.25,201.29 95.25,200.03 107.95,200.03 109.22,201.29 T32.1 109.22,201.93 109.86,202.56 | 109.86,222.88 109.22,223.52 T20.1 | 109.86,202.56 109.86,222.88 | 109.86,222.88 109.86,245.11 109.22,245.75 T8.1
  Bottom 0.762: T6.1 78.11,246.38 79.38,247.65 90.81,247.65 90.81,245.11 91.44,244.47 94.61,244.47 94.61,245.75 T7.1 | 81.28,178.44 77.47,174.62 77.47,172.09 64.77,157.8 T71.1 | 109.86,202.56 109.86,180.34 109.22,179.71 T44.1 | T52.1 154.31,100.33 155.57,101.6 168.28,101.6 168.28,100.33 T51.1 | 125.09,56.52 125.09,76.83 125.73,77.47 T42.1 125.73,78.11 125.09,78.74 125.09,102.23 | 125.09,56.52 125.73,55.88 T30.1 | 125.09,56.52 125.09,34.29 125.73,33.66 T18.1 | 125.09,110.49 125.09,102.23 | 125.09,102.23 T54.1 | 125.09,110.49 100.33,110.49 GND1.2 | D40.18 46.99,25.4 45.72,25.4 D40.20 | D40.19 45.72,22.86 46.99,22.86 D40.17 48.26,22.86 48.26,24.77 D40.18 | 48.26,54.29 48.26,25.4 D40.18 | 127.64,254 128.91,254 E40.20 | E40.17 127.64,256.54 128.91,256.54 E40.19 | 127.64,254 127.64,205.74 T33.1 | 127.64,254 E40.18 | F40.18 161.29,25.4 160.02,25.4 F40.20 | F40.17 161.29,22.86 160.02,22.86 F40.19 | T29.1 141.6,57.15 154.31,57.15 T28.1 | 196.53,105.41 186.69,105.41 186.69,104.78 182.88,100.97 T50.1
IF0
  Top 0.381: 50.8,248.28 51.44,248.92 51.44,254 C40.24 | 50.8,248.28 50.8,257.81 49.53,259.08 49.53,262.25 C40BOT.14 | T4.2 50.8,248.28
IF1
  Top 0.381: T5.2 64.77,248.28 55.88,248.28 55.88,255.91 55.24,256.54 C40.25
  Bottom 0.381: C40TOP.14 49.53,262.25 49.53,261.62 53.98,257.18 C40.25
IF2
  Top 0.381: C40BOT.19 57.15,262.25 63.5,262.25 63.5,255.27 64.14,254.63 C40.34
  Bottom 0.381: T6.2 79.38,244.47 69.22,244.47 69.22,250.19 65.41,254 C40.34
ION
  Top 0.381: T73.2 26.67,35.56 26.67,25.4 D40.34 26.67,24.77 26.04,24.13 26.04,17.14 34.92,17.14 F40BOT.19
IOT
  Bottom 0.381: 44.45,18.41 63.5,18.41 66.67,21.59 66.67,26.04 75.56,34.92 75.56,98.42 66.04,98.42 60.33,104.14 60.33,106.05 T88.2 | 44.45,18.41 F40TOP.13 | 44.45,18.41 40.64,22.23 D40.23
ISZ
  Top 0.381: F40BOT.3 60.33,17.14 60.96,17.78 60.96,18.41 64.14,21.59 64.14,24.13 63.5,24.77 D40.6
  Bottom 0.381: T84.2 59.69,61.59 43.18,61.59 43.18,60.33 41.91,59.05 39.37,59.05 39.37,64.14 51.44,76.2 74.3,76.2 74.3,36.2 63.5,25.4 D40.6
JMP
  Top 0.381: T87.2 59.69,95.25 55.88,91.44 55.88,25.4 D40.12 55.88,24.77 56.52,24.13 56.52,21.59 55.88,20.95 55.88,17.14 F40BOT.6
JMS
  Top 0.381: T86.2 58.42,82.55 58.42,25.4 D40.10 58.42,24.77 59.05,24.13 59.05,21.59 57.78,20.32 57.78,17.78 57.15,17.14 F40BOT.5
LINK
  Top 0.381: C40BOT.16 52.7,262.25 52.7,261.62 55.88,258.44 58.42,258.44 58.42,255.27 57.78,254.63 C40.28
  Bottom 0.381: T72.2 79.38,181.61 67.94,193.04 67.94,247.65 62.87,252.73 57.78,252.73 57.78,254 C40.28
MA0
  Bottom 0.381: T19.2 102.23,234.31 102.23,247.65 107.95,253.37 107.95,255.91 108.58,256.54 E40.3 109.86,257.18 109.86,259.71 113.67,259.71 115.57,261.62 115.57,262.25 D40TOP.2
MA1
  Top 0.381: T20.2 107.95,226.06 105.41,228.6 105.41,247.65 109.22,251.46 113.67,251.46 113.67,254 E40.8 114.94,254.63 115.57,255.27 115.57,257.81 118.75,260.99 118.75,262.25 D40BOT.4
MA2
  Bottom 0.381: D40TOP.7 123.83,262.25 123.19,261.62 123.19,257.81 122.56,257.18 E40.13 | 125.09,251.46 125.09,228.6 T21.2
  Bottom 0.406: E40.13 122.24,256.86 123.19,255.91 123.19,253.37 125.09,251.46
MA3
  Top 0.381: 132.72,248.92 132.72,254 E40.22 | 132.72,248.92 132.72,229.87 136.53,226.06 T22.2 | 132.72,248.92 128.27,253.37 128.27,257.81 131.44,260.99 131.44,262.25 D40BOT.12
MA4
  Bottom 0.381: T23.2 142.24,234.31 142.24,252.09 140.97,253.37 140.97,255.91 140.34,256.54 E40.27 139.06,257.18 137.16,259.08 137.16,261.62 136.53,262.25 D40TOP.15
MA5
  Top 0.381: T24.2 165.1,226.06 154.94,236.22 154.94,247.65 149.86,252.73 145.41,252.73 145.41,254 E40.32 144.15,254.63 143.51,255.27 143.51,257.81 141.6,259.71 141.6,262.25 D40BOT.18
MA6
  Bottom 0.381: T25.2 186.69,41.91 186.69,31.75 180.97,26.04 180.97,23.5 180.34,22.86 F40.3 179.07,22.23 176.53,19.68 176.53,17.14 E40TOP.2
MA7
  Top 0.381: 175.9,27.94 175.26,27.94 175.26,25.4 F40.8 | 175.9,27.94 182.88,27.94 186.69,31.75 186.69,50.8 184.15,53.34 T26.2 | 175.9,27.94 175.9,21.59 173.35,19.05 173.35,17.14 E40BOT.4
MA8
  Bottom 0.381: T27.2 165.74,49.53 165.74,23.5 166.37,22.86 F40.13 167.64,22.23 167.64,17.78 168.28,17.14 E40TOP.7
MA9
  Top 0.381: 158.12,28.57 158.12,26.04 157.48,25.4 F40.22 | 158.12,28.57 158.12,50.8 155.57,53.34 T28.2 | 158.12,28.57 160.66,26.04 160.66,17.14 E40BOT.12
MA10
  Bottom 0.381: E40TOP.15 155.57,17.14 154.94,17.78 154.94,18.41 152.08,21.27 149.86,21.27 149.86,22.23 F40.27 148.59,22.86 147.96,23.5 147.96,29.84 140.34,29.84 138.43,31.75 138.43,50.8 T29.2
MA11
  Top 0.381: E40BOT.18 150.5,17.14 150.5,17.78 148.59,19.68 145.41,19.68 145.41,24.13 144.78,24.77 F40.32 143.51,25.4 137.16,31.75 137.16,43.18 127,53.34 T30.2
MB0
  Bottom 0.381: T31.2 92.08,205.1 92.08,219.71 94.61,222.25 103.5,222.25 103.5,246.38 110.49,253.37 110.49,255.91 111.12,256.54 E40.5 112.39,257.18 112.39,258.44 114.3,258.44 116.84,260.99 116.84,261.62 117.47,262.25 D40TOP.3
MB1
  Top 0.381: T32.2 107.95,203.84 104.14,207.65 104.14,247.65 109.22,252.73 111.12,252.73 111.12,254 E40.6 112.39,254.63 113.03,255.27 113.03,258.44 114.3,258.44 116.84,260.99 116.84,261.62 117.47,262.25 D40BOT.3
MB2
  Bottom 0.381: 125.73,256.54 125.73,262.25 D40TOP.8 | 125.73,256.54 125.09,256.54 E40.15 | T33.2 126.36,207.65 126.36,252.73 125.73,253.37 125.73,256.54
MB3
  Top 0.381: 125.73,253.37 125.09,254 E40.16 | 125.73,253.37 126.36,252.73 126.36,214 136.53,203.84 T34.2 | 125.73,253.37 125.73,258.44 127,258.44 129.54,260.99 129.54,261.62 130.18,262.25 D40BOT.11
MB4
  Bottom 0.381: T35.2 153.67,206.38 153.67,232.41 143.51,242.57 143.51,255.91 142.88,256.54 E40.29 141.6,257.18 138.43,260.35 138.43,262.25 D40TOP.16
MB5
  Top 0.381: T36.2 165.1,203.84 153.67,215.26 153.67,247.65 151.13,250.19 142.88,250.19 142.88,254 E40.30 141.6,254.63 140.97,255.27 140.97,257.81 140.34,258.44 140.34,261.62 139.7,262.25 D40BOT.17
MB6
  Bottom 0.381: T37.2 198.12,75.56 185.42,75.56 185.42,67.31 178.44,60.33 178.44,23.5 177.8,22.86 F40.5 176.53,22.23 175.26,20.95 175.26,17.78 174.62,17.14 E40TOP.3
MB7
  Top 0.381: E40BOT.3 174.62,17.14 175.26,17.78 175.26,18.41 178.44,21.59 178.44,24.13 177.8,24.77 F40.6
  Bottom 0.381: T38.2 184.15,75.56 177.16,68.58 F40.6
MB8
  Bottom 0.381: T39.2 163.19,69.22 163.19,23.5 163.83,22.86 F40.15 165.1,22.23 166.37,20.95 166.37,17.14 E40TOP.8
MB9
  Top 0.381: T40.2 155.57,75.56 163.83,67.31 163.83,25.4 F40.16 163.83,24.77 163.19,24.13 163.19,21.59 162.56,20.95 162.56,17.78 161.93,17.14 E40BOT.11
MB10
  Bottom 0.381: E40TOP.16 153.67,17.14 153.67,18.1 151.45,20.32 147.32,20.32 147.32,22.23 F40.29 146.05,22.86 145.41,23.5 145.41,28.26 140.65,28.26 137.16,31.75 137.16,71.75 T41.2
MB11
  Top 0.381: E40BOT.17 152.4,17.14 151.76,17.78 151.76,18.41 149.22,20.95 147.96,20.95 147.96,23.18 146.69,24.45 F40.30 146.05,25.4 146.05,26.67 143.51,26.67 138.43,31.75 138.43,64.14 127,75.56 T42.2
MQ0
  Bottom 0.381: T55.2 90.81,159.07 90.81,156.53 91.44,155.89 105.41,155.89 105.41,173.99 107.95,176.53 115.57,176.53 115.57,255.91 116.2,256.54 E40.9 117.47,257.18 120.02,259.71 120.02,261.62 120.65,262.25 D40TOP.5
MQ1
  Top 0.381: T56.2 107.95,159.7 100.97,168.28 100.97,248.92 106.05,254 E40.2 107.31,254.63 107.95,255.27 107.95,262.25 114.3,262.25 D40BOT.1
MQ2
  Bottom 0.381: 133.35,256.54 133.35,253.37 132.08,252.09 132.08,170.18 122.56,159.07 T57.2 | 133.35,256.54 D40TOP.13 | 133.35,256.54 133.99,256.54 E40.23
MQ3
  Top 0.381: T58.2 125.09,159.07 125.09,165.74 119.38,171.45 E40.12 120.02,254.63 120.65,255.27 120.65,257.81 121.92,259.08 121.92,262.25 D40BOT.6
MQ4
  Bottom 0.381: T59.2 147.96,159.07 147.96,156.53 148.59,155.89 162.56,155.89 162.56,166.37 167.64,171.45 167.64,188.59 158.12,198.12 158.12,246.38 147.96,256.54 E40.33 146.69,257.18 146.69,258.44 144.78,258.44 141.6,261.62 141.6,262.25 D40TOP.18
MQ5
  Top 0.381: T60.2 165.1,154.62 167,152.72 167,148.27 166.37,147.64 139.7,147.64 139.7,252.09 137.79,254 E40.26 136.53,254.63 135.89,255.27 135.89,261.62 136.53,262.25 D40BOT.15
MQ6
  Bottom 0.381: T61.2 201.29,120.33 201.29,122.87 200.66,123.51 186.69,123.51 186.69,113.03 173.99,100.33 173.99,26.67 173.35,26.04 173.35,23.5 172.72,22.86 F40.9 171.45,22.23 E40TOP.5
MQ7
  Top 0.381: 183.51,25.4 182.88,24.77 F40.2 | 183.51,25.4 190.5,32.38 190.5,80.64 201.29,91.44 201.29,131.76 182.88,131.76 182.25,131.13 182.25,126.68 184.15,124.78 T62.2 | 183.51,25.4 183.51,17.14 177.8,17.14 E40BOT.1
MQ8
  Bottom 0.381: T63.2 160.02,120.33 160.02,128.59 156.84,131.76 152.4,131.76 152.4,91.44 158.12,85.72 158.12,28.57 155.57,26.04 155.57,23.5 154.94,22.86 F40.23 154.94,22.23 158.12,19.05 158.12,17.78 158.75,17.14 E40TOP.13
MQ9
  Top 0.381: E40BOT.6 170.18,17.14 170.18,20.95 170.81,21.59 170.81,24.13 170.18,24.77 F40.12
  Bottom 0.381: T64.2 155.57,119.7 153.67,117.79 153.67,104.78 155.57,102.87 172.72,102.87 172.72,27.94 170.18,25.4 F40.12
MQ10
  Bottom 0.381: T65.2 140.97,120.33 134.62,112.39 134.62,29.21 140.97,22.86 F40.33 142.24,22.23 142.24,18.41 149.86,18.41 150.5,17.78 150.5,17.14 E40TOP.18
MQ11
  Top 0.381: T66.2 127,119.7 138.43,106.68 138.43,70.48 151.13,57.78 151.13,25.4 F40.26 152.4,24.77 153.03,24.13 153.03,21.59 154.94,19.68 154.94,17.78 155.57,17.14 E40BOT.15
N$1
  Top 0.381: T1.3 7.62,245.11 7.62,241.3 DF0.B
N$2
  Bottom 0.381: T2.3 20.95,245.75 21.59,245.11 21.59,241.3 DF1.B
N$3
  Bottom 0.381: T3.3 36.2,245.11 36.2,241.3 DF2.B
N$4
  Top 0.381: T4.3 49.53,245.75 50.16,245.11 50.16,241.3 IF0.B
N$5
  Top 0.381: T5.3 64.77,245.11 64.77,241.3 IF1.B
N$6
  Top 0.381: T6.3 80.64,241.94 IF2.B
N$7
  Top 0.381: T7.3 93.34,245.11 93.34,241.3 PC0.B
N$8
  Top 0.381: T8.3 106.68,245.75 107.31,245.11 107.31,241.3 PC1.B
N$9
  Top 0.381: T9.3 121.92,245.11 121.92,241.3 PC2.B
N$10
  Top 0.381: T10.3 135.25,245.75 135.89,245.11 135.89,241.3 PC3.B
N$11
  Top 0.381: T11.3 150.5,245.11 150.5,241.3 PC4.B
N$12
  Top 0.381: T12.3 163.83,245.75 164.47,245.11 164.47,241.3 PC5.B
N$13
  Top 0.381: T13.3 198.75,34.29 198.75,38.1 PC6.B
N$14
  Top 0.381: T14.3 185.42,33.66 184.78,34.29 184.78,38.1 PC7.B
N$15
  Top 0.381: T15.3 170.18,34.29 170.18,38.1 PC8.B
N$16
  Top 0.381: T16.3 156.84,37.47 PC9.B
N$17
  Top 0.381: T17.3 141.6,34.29 141.6,38.1 PC10.B
N$18
  Top 0.381: T18.3 128.27,33.66 127.64,34.29 127.64,38.1 PC11.B
N$19
  Top 0.381: T19.3 93.34,222.88 93.34,219.07 MA0.B
N$20
  Top 0.381: T20.3 106.68,223.52 107.31,222.88 107.31,219.07 MA1.B
N$21
  Top 0.381: T21.3 121.92,222.88 121.92,219.07 MA2.B
N$22
  Top 0.381: T22.3 135.25,223.52 135.89,222.88 135.89,219.07 MA3.B
N$23
  Top 0.381: T23.3 150.5,222.88 150.5,219.07 MA4.B
N$24
  Top 0.381: T24.3 163.83,223.52 164.47,222.88 164.47,219.07 MA5.B
N$25
  Top 0.381: T25.3 198.75,56.52 198.75,60.33 MA6.B
N$26
  Top 0.381: T26.3 185.42,55.88 184.78,56.52 184.78,60.33 MA7.B
N$27
  Top 0.381: T27.3 170.18,56.52 170.18,60.33 MA8.B
N$28
  Top 0.381: T28.3 156.84,55.88 156.21,56.52 156.21,60.33 MA9.B
N$29
  Top 0.381: T29.3 141.6,56.52 141.6,60.33 MA10.B
N$30
  Top 0.381: T30.3 128.27,55.88 127.64,56.52 127.64,60.33 MA11.B
N$31
  Top 0.381: T31.3 93.34,200.66 93.34,196.85 MB0.B
N$32
  Top 0.381: T32.3 106.68,201.29 107.31,200.66 107.31,196.85 MB1.B
N$33
  Top 0.381: T33.3 121.92,200.66 121.92,196.85 MB2.B
N$34
  Top 0.381: T34.3 135.25,201.29 135.89,200.66 135.89,196.85 MB3.B
N$35
  Top 0.381: T35.3 150.5,200.66 150.5,196.85 MB4.B
N$36
  Top 0.381: T36.3 163.83,201.29 164.47,200.66 164.47,196.85 MB5.B
N$37
  Top 0.381: T37.3 198.75,78.74 198.75,82.55 MB6.B
N$38
  Top 0.381: T38.3 185.42,81.92 MB7.B
N$39
  Bottom 0.381: T39.3 170.18,78.74 170.18,82.55 MB8.B
N$40
  Top 0.381: T40.3 156.84,78.11 156.21,78.74 156.21,82.55 MB9.B
N$41
  Top 0.381: T41.3 141.6,78.74 141.6,82.55 MB10.B
N$42
  Top 0.381: T42.3 128.27,78.11 127.64,78.74 127.64,82.55 MB11.B
N$43
  Top 0.381: T43.3 93.34,178.44 93.34,174.62 AC0.B
N$44
  Top 0.381: T44.3 106.68,179.07 107.31,178.44 107.31,174.62 AC1.B
N$45
  Bottom 0.381: T45.3 121.92,178.44 121.92,174.62 AC2.B
N$46
  Top 0.381: T46.3 135.25,179.07 135.89,178.44 135.89,174.62 AC3.B
N$47
  Top 0.381: T47.3 150.5,178.44 150.5,174.62 AC4.B
N$48
  Top 0.381: T48.3 163.83,179.07 164.47,178.44 164.47,174.62 AC5.B
N$49
  Top 0.381: T49.3 198.75,100.97 198.75,104.78 AC6.B
N$50
  Top 0.381: T50.3 185.42,100.33 184.78,100.97 184.78,104.78 AC7.B
N$51
  Top 0.381: T51.3 170.18,100.97 170.18,104.78 AC8.B
N$52
  Top 0.381: T52.3 156.84,100.33 156.21,100.97 156.21,104.78 AC9.B
N$53
  Bottom 0.381: T53.3 141.6,100.97 141.6,104.78 AC10.B
N$54
  Top 0.381: T54.3 127.64,102.23 127.64,104.78 AC11.B
N$55
  Top 0.381: T55.3 92.71,157.16 93.34,156.53 93.34,152.08 MQ0.B
N$56
  Top 0.381: T56.3 106.68,156.53 107.31,155.89 107.31,152.08 MQ1.B
N$57
  Top 0.381: T57.3 121.28,157.16 121.92,156.53 121.92,152.08 MQ2.B
N$58
  Top 0.381: T58.3 135.25,156.53 135.89,155.89 135.89,152.08 MQ3.B
N$59
  Top 0.381: T59.3 149.86,157.16 150.5,156.53 150.5,152.08 MQ4.B
N$60
  Bottom 0.381: T60.3 163.83,156.53 164.47,155.89 164.47,152.08 MQ5.B
N$61
  Top 0.381: T61.3 199.39,122.24 198.75,122.87 198.75,127.32 MQ6.B
N$62
  Bottom 0.381: T62.3 185.42,122.87 184.78,123.51 184.78,127.32 MQ7.B
N$63
  Top 0.381: T63.3 170.81,122.24 170.18,122.87 170.18,127.32 MQ8.B
N$64
  Top 0.381: T64.3 156.84,122.87 156.21,123.51 156.21,127.32 MQ9.B
N$65
  Top 0.381: T65.3 142.24,122.24 141.6,122.87 141.6,127.32 MQ10.B
N$66
  Top 0.381: T66.3 128.27,122.87 127.64,123.51 127.64,127.32 MQ11.B
N$67
  Top 0.381: T67.3 5.08,156.53 5.71,155.89 5.71,152.08 SC0.B
N$68
  Top 0.381: T68.3 19.68,157.16 20.32,156.53 20.32,152.08 SC1.B
N$69
  Bottom 0.381: T69.3 33.66,156.53 34.29,155.89 34.29,152.08 SC2.B
N$70
  Bottom 0.381: T70.3 48.26,157.16 48.9,156.53 48.9,152.08 SC3.B
N$71
  Bottom 0.381: T71.3 62.23,156.53 62.87,155.89 62.87,152.08 SC4.B
N$72
  Top 0.381: T72.3 78.11,179.07 78.74,178.44 78.74,174.62 LINK.B
N$73
  Bottom 0.381: T73.3 20.32,40.64 14.61,40.64 ION.B
N$74
  Bottom 0.381: T74.3 14.61,52.07 14.61,51.44 13.34,50.16 PAUSE.B
N$75
  Top 0.381: T75.3 20.32,62.87 14.61,62.87 RUN.B
N$76
  Bottom 0.381: T76.3 33.66,38.73 FETCH.B
N$77
  Bottom 0.381: T77.3 40.64,49.53 EXECUTE.B
N$78
  Top 0.381: T78.3 33.66,60.96 DEFER.B
N$79
  Bottom 0.381: T79.3 40.64,71.75 WORDCOUNT.B
N$80
  Bottom 0.381: T80.3 33.66,83.19 CURRENTADDRESS.B
N$81
  Bottom 0.381: T81.3 40.64,93.98 BREAK.B
N$82
  Top 0.381: T82.3 62.23,38.73 AND.B
N$83
  Bottom 0.381: T83.3 69.22,49.53 TAD.B
N$84
  Bottom 0.381: T84.3 62.23,60.96 ISZ.B
N$85
  Bottom 0.381: T85.3 69.22,71.75 DCA.B
N$86
  Bottom 0.381: T86.3 62.23,83.19 JMS.B
N$87
  Bottom 0.381: T87.3 69.22,93.98 JMP.B
N$88
  Bottom 0.381: T88.3 62.23,105.41 IOT.B
N$89
  Bottom 0.381: T89.3 69.22,116.2 OPR.B
OPR
  Top 0.381: T89.2 59.69,117.47 48.26,106.05 48.26,26.67 49.53,25.4 D40.16 49.53,24.77 48.9,24.13 48.9,19.05 47.62,17.78 F40BOT.11
PAUSE
  Bottom 0.381: 33.02,20.95 33.66,21.59 33.66,27.94 20.95,27.94 10.79,38.1 10.79,41.91 15.24,46.35 15.24,50.8 T74.2 | 33.02,20.95 30.48,20.95 30.48,22.23 D40.31 | 33.02,20.95 34.92,20.95 37.47,18.41 37.47,17.78 38.1,17.14 F40TOP.17
PC0
  Top 0.381: T7.2 102.23,256.54 106.05,256.54 E40.1
  Bottom 0.381: D40TOP.1 114.3,262.25 107.31,262.25 107.31,257.18 E40.1
PC1
  Top 0.381: T8.2 107.95,248.28 116.2,248.28 116.2,254 E40.10 117.47,254.63 118.11,255.27 118.11,257.81 120.02,259.71 120.02,261.62 120.65,262.25 D40BOT.5
PC2
  Bottom 0.381: 120.65,257.81 120.02,257.18 E40.11 | 120.65,257.81 121.92,259.08 121.92,262.25 D40TOP.6 | 120.65,257.81 120.65,249.56 T9.2
PC3
  Top 0.381: T10.2 136.53,248.28 135.25,249.56 135.25,254 E40.24 133.99,254.63 133.35,255.27 133.35,257.81 134.62,259.08 134.62,262.25 D40BOT.14
PC4
  Bottom 0.381: T11.2 151.13,247.65 153.67,247.65 153.67,233.68 154.94,232.41 154.94,201.93 153.03,200.03 140.97,200.03 140.97,250.82 138.43,253.37 138.43,255.91 137.79,256.54 E40.25 136.53,257.18 135.25,258.44 135.25,262.25 D40TOP.14
PC5
  Top 0.381: 148.59,254 147.96,254 E40.34 | 148.59,254 149.86,254 155.57,248.28 165.1,248.28 T12.2 | 148.59,254 148.59,262.25 142.88,262.25 D40BOT.19
PC6
  Bottom 0.381: T13.2 198.12,31.11 187.32,31.11 187.32,27.3 182.88,22.86 F40.1 181.61,22.23 181.61,20.95 177.8,17.14 E40TOP.1
PC7
  Top 0.381: 173.35,26.04 172.72,25.4 F40.10 | 173.35,26.04 173.99,26.67 173.99,31.11 184.15,31.11 T14.2 | 173.35,26.04 173.35,21.59 172.09,20.32 172.09,17.78 171.45,17.14 E40BOT.5
PC8
  Bottom 0.381: T15.2 168.28,29.84 168.28,23.5 168.91,22.86 F40.11 170.18,22.23 170.18,17.14 E40TOP.6
PC9
  Top 0.381: 155.57,31.11 154.94,30.48 154.94,25.4 F40.24 | 155.57,31.11 155.57,21.59 156.84,20.32 156.84,17.14 E40BOT.14 | 155.57,31.11 T16.2
PC10
  Bottom 0.381: T17.2 141.6,31.11 150.5,31.11 150.5,23.5 151.13,22.86 F40.25 152.4,22.23 156.84,17.78 156.84,17.14 E40TOP.14
PC11
  Top 0.381: 140.34,26.04 140.97,25.4 F40.34 | 140.34,26.04 136.53,29.84 136.53,31.11 127,31.11 T18.2 | 140.34,26.04 140.34,17.14 149.22,17.14 E40BOT.19
RUN
  Top 0.381: T75.2 27.3,57.15 27.3,36.2 28.57,34.92 28.57,23.5 27.94,22.86 D40.33
  Bottom 0.381: F40TOP.18 36.2,17.14 36.2,17.78 34.29,19.68 27.94,19.68 27.94,22.23 D40.33
SC0
  Bottom 0.381: 36.83,259.71 34.92,261.62 C40TOP.5 | 36.83,259.71 38.1,258.44 38.1,253.37 33.66,248.92 33.66,188.59 6.35,159.7 T67.2 | 36.83,259.71 36.83,259.08 34.92,257.18 C40.9
SC1
  Top 0.381: 22.86,252.09 23.5,252.09 23.5,254 C40.2 | 22.86,252.09 9.53,252.09 5.08,247.65 5.08,175.9 20.32,159.07 T68.2 | 22.86,252.09 22.86,262.25 28.57,262.25 C40BOT.1
SC2
  Top 0.381: T69.2 34.92,159.7 53.34,179.71 53.34,255.91 52.7,256.54 C40.23
  Bottom 0.381: C40TOP.13 47.62,262.25 48.26,261.62 48.26,260.35 51.44,257.18 C40.23
SC3
  Top 0.381: C40BOT.6 36.83,262.25 36.83,259.08 38.1,257.81 38.1,255.27 37.47,254.63 C40.12
  Bottom 0.381: T70.2 37.47,159.07 37.47,148.91 36.2,147.64 3.81,147.64 3.81,217.17 32.38,245.75 32.38,250.19 36.2,254 C40.12
SC4
  Bottom 0.381: 55.88,258.44 55.88,262.25 C40TOP.18 | 55.88,258.44 55.88,252.73 53.34,252.73 48.26,247.65 48.26,176.53 63.5,159.7 T71.2 | 55.88,258.44 62.87,258.44 64.14,257.18 C40.33
TAD
  Top 0.381: F40BOT.2 62.23,17.14 62.23,17.78 65.41,20.95 66.67,20.95 66.67,24.13 66.04,24.77 D40.4
  Bottom 0.381: T83.2 59.69,50.8 58.42,49.53 58.42,26.67 59.05,26.04 59.05,21.59 59.69,20.95 64.14,20.95 64.14,24.13 64.77,24.77 D40.4
WC
  Top 0.381: F40BOT.17 38.1,17.14 37.47,17.78 37.47,18.41 34.92,20.95 33.66,20.95 33.66,24.13 33.02,24.77 D40.30
  Bottom 0.381: T79.2 34.92,73.03 34.92,74.93 33.66,76.2 9.53,76.2 9.53,38.1 20.95,26.67 31.75,26.67 31.75,25.4 D40.30

## Text on the board
Bottom: 5404519 | PDP-8/I Light Board 50045108